# Altium project nira_avr_dev_board.PrjPcb (part 2 of 2)

## Sheet power.SchDoc
size A4; SheetNumber: 24; SheetTotal: 25
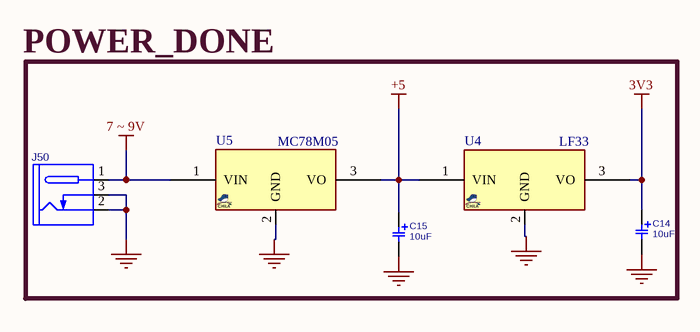
[diagram p23: power.SchDoc]

### Parts
C14  10uF  [C_EL_4X7]
C15  10uF  [C_EL_4X7]
J50  DC_POWER_JACK  [JAC_PWR1]  (value not drawn)
U4  LF33  [TO220_3]
U5  MC78M05  [TO220_3]

### Blocks framed on the sheet
POWER_DONE: C14 C15 J50 U4 U5

### Nets
3V3: C14.1 U4.3(VO)
7 ~ 9V: J50.1(TIP) U5.1(VIN)
+5: C15.1 U4.1(VIN) U5.3(VO)  [project net LEDA_]
GND: C14.2 C15.2 J50.2(SLEEVE) J50.3(INSERTION_DET) U4.2(GND) U5.2(GND)

### Library data of the parts
C14 C15 = CAP_THD_EL_10u25V: CAP, THD, ELEC, 10uF, 25V; MANF_P#: MANF_PART#; PARAM: 25V; MANF: MANF; PARAM2: PARAM2; VALUE: 10uF
J50 = CONN_PWR_JACKR1: CONN, PWR JACK DC, PLUG DIAM 1.0MM RA THD; MANF: CUI STACK; MANF_P#: PJ-031CH, PJ-031C; PARAM: CH 3A, C 2A; VALUE: DC_POWER_JACK
U4 = VREG_LFXX_TO220: REG, Linear, LDO0.45V, 0.5A, TO-220; MANF: ST; PARAM2: 1.5/1.8/2.5/3.3/5V; MANF_P#: LF33; PARAM: LDO0.45V, 0.5A; PRICE: 1500t; VALUE: LF33
U5 = VREG_78M05_TO220: REG, Linear, Fixed, 5v, 1.5A, TO-220; MANF_P#: LM78M05CT, LM7805CT, LM7805ACT, UA7805CKC, L7805ABV, L7805ACV, L7805CV, L78M05CV, KA78T05, KA7805ETU, MC78M05BT, MC78M05CT, MC7805ACT, MC7805ABT, NCP7805TG, NJM7805FA, TS7805CZ; MANF: TI, ST, FAIRCHILD, ON, NJR, TS; PARAM: 5v, 1.5A; PARAM2: PARAM2; VALUE: MC78M05

## Sheet programmer.SchDoc
size A4; SheetNumber: 25; SheetTotal: 25
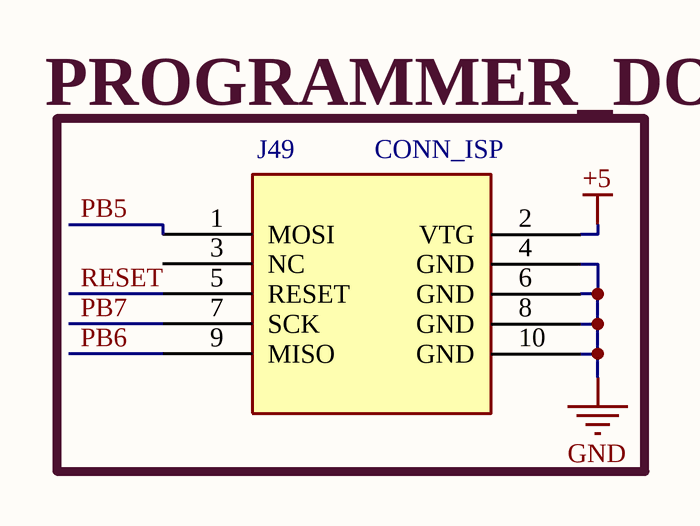
[diagram p24: programmer.SchDoc]

### Parts
J49  CONN_ISP  [IDC_2X5]

### Nets
+5: J49.2(VTG)  [project net LEDA_]
GND: J49.4(GND) J49.6(GND) J49.8(GND) J49.10(GND)
PB5: J49.1(MOSI)
PB6: J49.9(MISO)
PB7: J49.7(SCK)
RESET: J49.5(RESET)

Not connected (* = marked no-connect by the designer): J49 3(NC)

### Notes on the sheet
- (near J49) PROGRAMMER_DONE

### Library data of the parts
J49 = CONN_AVR_ISP_IDC10: CONN, ISP, AVR; VALUE: CONN_ISP

## Nets that join several sheets
+12: dc_motor (7 pins), relay (D9.2 D10.2 K1.4 K2.4)
GND: main (10 pins), rs232_usart (C7.1 P1.5), stepper_motor (Q1.8), dc_motor (10 pins), relay (Q2.1 Q3.1), lcd_16_2 (J35.1 J35.16 R11.1), glcd_128_64 (J12.1 J48.2 R12.3), push_button (9 pins), pull_up_pull_down_switch (R25.2 R26.2 R27.2 R28.2), temp_lm35 (R29.1 U6.1), buzzer (BZ1.2 J22.2), led (R59.1), eeprom (5 pins), rtc (BT1.2 D19.2 U7.4), mmc_sd (R41.1 R42.1 R43.1), ps2_connector (PS1.3 PS1.S), infra_red (5 pins), digital_pot (U10.4 U10.7), phase_locked_loop (5 pins), rs485 (J34.5 U12.5 U13.5), power (6 pins), programmer (J49.4 J49.6 J49.8 J49.10)
LEDA_: main (J38.3 J38.4 R1.2 U1.10), rs232_usart (C4.2 U2.16), stepper_motor (5 pins), dc_motor (C9.2 U3.9), lcd_16_2 (J35.2 J35.15 R11.3), glcd_128_64 (J12.2 J45.8 J48.1), seven_segment (Q4.3 Q5.3 Q6.3 Q7.3), keypad (R17.2 R18.2 R19.2 R20.2), pull_up_pull_down_switch (R21.2 R22.2 R23.2 R24.2), temp_lm35 (R29.3 U6.3), eeprom (R32.2 R33.2 U8.8), rtc (R30.1 R31.1 U7.8), rgb_led (R34.2), ps2_connector (PS1.4 R44.1 R47.1), infra_red (R48.1 U9.8), digital_pot (U10.5 U10.8), phase_locked_loop (R56.1 U11.16), rs485 (U12.8 U13.2 U13.3 U13.8), power (C15.1 U4.1 U5.3), programmer (J49.2)
PB5: main (J24.11 J24.12 U1.6), programmer (J49.1)
PB6: main (J24.13 J24.14 U1.7), programmer (J49.9)
PB7: main (J24.15 J24.16 U1.8), programmer (J49.7)
RESET: main (7 pins), programmer (J49.5)